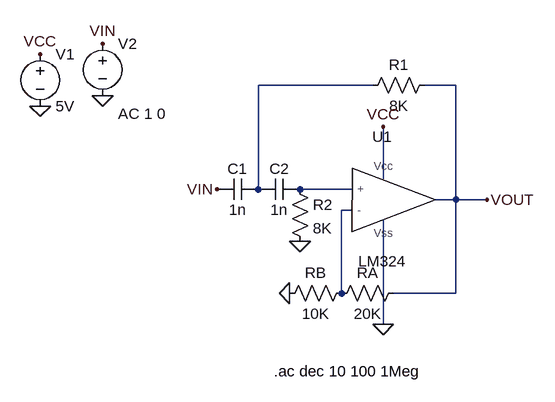
[diagram p0: schematic BAI 4 CHUAN BI 2.asc]
BAI 4 CHUAN BI 2.asc, the LTspice schematic file:
Version 4.1
SHEET 1 880 680
WIRE 224 -48 48 -48
WIRE 352 -48 304 -48
WIRE 240 96 240 16
WIRE 48 112 48 -48
WIRE 192 112 112 112
WIRE 352 128 352 -48
WIRE 352 128 320 128
WIRE 400 128 352 128
WIRE 192 144 176 144
WIRE 176 272 176 144
WIRE 352 272 352 128
WIRE 352 272 256 272
WIRE 240 320 240 160
FLAG 400 128 VOUT
FLAG 112 192 0
FLAG 96 272 0
FLAG -16 112 VIN
FLAG 240 16 VCC
FLAG -192 -32 0
FLAG -288 -16 0
FLAG -288 -96 VCC
FLAG -192 -112 VIN
FLAG 240 320 0
SYMBOL LM324 240 128 R0
SYMATTR InstName U1
SYMBOL res 320 -64 R90
WINDOW 0 0 56 VBottom 2
WINDOW 3 32 56 VTop 2
SYMATTR InstName R1
SYMATTR Value 8K
SYMBOL cap 48 96 R90
WINDOW 0 0 32 VBottom 2
WINDOW 3 32 32 VTop 2
SYMATTR InstName C1
SYMATTR Value 1n
SYMBOL cap 112 96 R90
WINDOW 0 0 32 VBottom 2
WINDOW 3 32 32 VTop 2
SYMATTR InstName C2
SYMATTR Value 1n
SYMBOL res 96 96 R0
SYMATTR InstName R2
SYMATTR Value 8K
SYMBOL res 272 256 R90
WINDOW 0 0 56 VBottom 2
WINDOW 3 32 56 VTop 2
SYMATTR InstName RA
SYMATTR Value 20K
SYMBOL res 192 256 R90
WINDOW 0 0 56 VBottom 2
WINDOW 3 32 56 VTop 2
SYMATTR InstName RB
SYMATTR Value 10K
SYMBOL voltage -288 -112 R0
SYMATTR InstName V1
SYMATTR Value 5V
SYMBOL voltage -192 -128 R0
WINDOW 123 24 124 Left 2
WINDOW 39 0 0 Left 0
SYMATTR InstName V2
SYMATTR Value ""
SYMATTR Value2 AC 1 0
TEXT 72 392 Left 2 !.ac dec 10 100 1Meg

The netlist it stands for:
* BAI 4 CHUAN BI 2.asc
X§U1 N002 N003 VCC 0 VOUT LM324  ; pins + - Vcc Vss ?
R1 VOUT N001 8K
C1 N001 VIN 1n
C2 N002 N001 1n
R2 N002 0 8K
RA VOUT N003 20K
RB N003 0 10K
V1 VCC 0 5V
V2 VIN 0 AC 1 0
.ac dec 10 100 1Meg
.lib E:\ThiThucHanhCoHa\CoHa\LM324.cir
.backanno
.end